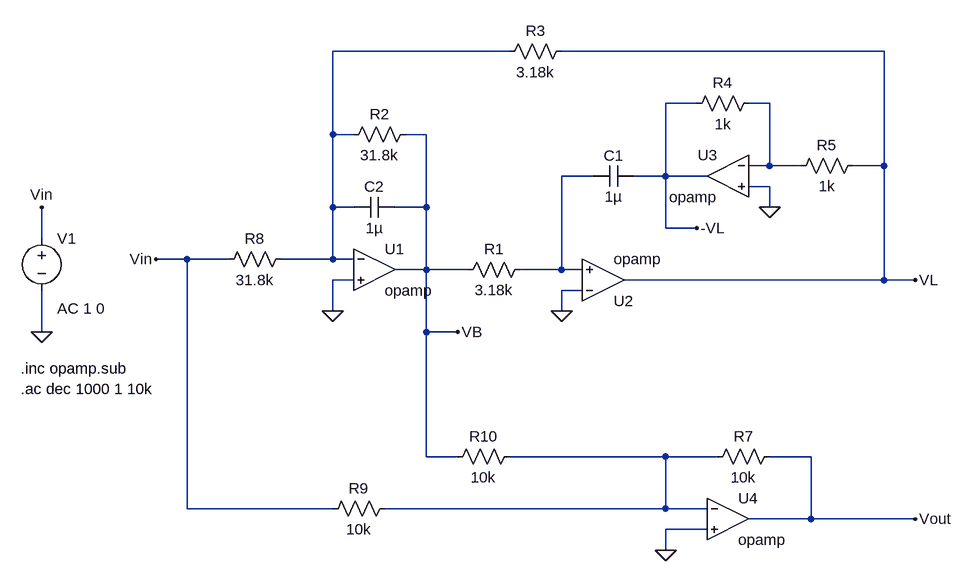
[diagram p0: schematic SimulacionEjercicio8b.asc]
SimulacionEjercicio8b.asc, the LTspice schematic file:
Version 4
SHEET 1 904 680
WIRE 208 -160 -64 -160
WIRE 784 -160 288 -160
WIRE 496 -80 448 -80
WIRE 608 -80 576 -80
WIRE -64 -32 -64 -160
WIRE -32 -32 -64 -32
WIRE 80 -32 48 -32
WIRE 608 16 608 -80
WIRE 608 16 576 16
WIRE 656 16 608 16
WIRE 784 16 784 -160
WIRE 784 16 736 16
WIRE 336 32 288 32
WIRE 448 32 448 -80
WIRE 448 32 400 32
WIRE 512 32 448 32
WIRE 608 48 576 48
WIRE -64 80 -64 -32
WIRE -32 80 -64 80
WIRE 80 80 80 -32
WIRE 80 80 32 80
WIRE 608 80 608 48
WIRE 448 112 448 32
WIRE 496 112 448 112
WIRE -512 128 -512 80
WIRE -288 160 -336 160
WIRE -224 160 -288 160
WIRE -64 160 -64 80
WIRE -64 160 -144 160
WIRE -32 160 -64 160
WIRE 80 176 80 80
WIRE 80 176 32 176
WIRE 144 176 80 176
WIRE 288 176 288 32
WIRE 288 176 224 176
WIRE 320 176 288 176
WIRE -32 192 -64 192
WIRE 784 192 784 16
WIRE 784 192 384 192
WIRE 832 192 784 192
WIRE 320 208 288 208
WIRE -64 240 -64 192
WIRE 288 240 288 208
WIRE -512 272 -512 208
WIRE 80 272 80 176
WIRE 128 272 80 272
WIRE 80 464 80 272
WIRE 128 464 80 464
WIRE 448 464 208 464
WIRE 528 464 448 464
WIRE 672 464 608 464
WIRE -288 544 -288 160
WIRE -64 544 -288 544
WIRE 448 544 448 464
WIRE 448 544 16 544
WIRE 512 544 448 544
WIRE 672 560 672 464
WIRE 672 560 576 560
WIRE 832 560 672 560
WIRE 512 576 448 576
WIRE 448 608 448 576
FLAG 608 80 0
FLAG 288 240 0
FLAG -64 240 0
FLAG 448 608 0
FLAG -336 160 Vin
FLAG 832 192 VL
FLAG 128 272 VB
FLAG 496 112 -VL
FLAG 832 560 Vout
FLAG -512 80 Vin
FLAG -512 272 0
SYMBOL OpAmps\\opamp 0 112 R0
SYMATTR InstName U1
SYMBOL OpAmps\\opamp 352 256 M180
SYMATTR InstName U2
SYMBOL OpAmps\\opamp 544 -32 M0
SYMATTR InstName U3
SYMBOL OpAmps\\opamp 544 496 R0
SYMATTR InstName U4
SYMBOL res 240 160 R90
WINDOW 0 0 56 VBottom 2
WINDOW 3 32 56 VTop 2
SYMATTR InstName R1
SYMATTR Value 3.18k
SYMBOL res 64 -48 R90
WINDOW 0 0 56 VBottom 2
WINDOW 3 32 56 VTop 2
SYMATTR InstName R2
SYMATTR Value 31.8k
SYMBOL res 304 -176 R90
WINDOW 0 0 56 VBottom 2
WINDOW 3 32 56 VTop 2
SYMATTR InstName R3
SYMATTR Value 3.18k
SYMBOL res 592 -96 R90
WINDOW 0 0 56 VBottom 2
WINDOW 3 32 56 VTop 2
SYMATTR InstName R4
SYMATTR Value 1k
SYMBOL res 752 0 R90
WINDOW 0 0 56 VBottom 2
WINDOW 3 32 56 VTop 2
SYMATTR InstName R5
SYMATTR Value 1k
SYMBOL res 512 480 R270
WINDOW 0 32 56 VTop 2
WINDOW 3 0 56 VBottom 2
SYMATTR InstName R7
SYMATTR Value 10k
SYMBOL res -128 144 R90
WINDOW 0 0 56 VBottom 2
WINDOW 3 32 56 VTop 2
SYMATTR InstName R8
SYMATTR Value 31.8k
SYMBOL res 32 528 R90
WINDOW 0 0 56 VBottom 2
WINDOW 3 32 56 VTop 2
SYMATTR InstName R9
SYMATTR Value 10k
SYMBOL res 112 480 R270
WINDOW 0 32 56 VTop 2
WINDOW 3 0 56 VBottom 2
SYMATTR InstName R10
SYMATTR Value 10k
SYMBOL cap 400 16 R90
WINDOW 0 0 32 VBottom 2
WINDOW 3 32 32 VTop 2
SYMATTR InstName C1
SYMATTR Value 1µ
SYMBOL cap 32 64 R90
WINDOW 0 0 32 VBottom 2
WINDOW 3 32 32 VTop 2
SYMATTR InstName C2
SYMATTR Value 1µ
SYMBOL voltage -512 112 R0
WINDOW 123 24 124 Left 2
WINDOW 39 0 0 Left 0
SYMATTR InstName V1
SYMATTR Value ""
SYMATTR Value2 AC 1 0
TEXT -544 328 Left 2 !.inc opamp.sub
TEXT -544 360 Left 2 !.ac dec 1000 1 10k

The netlist it stands for:
* SimulacionEjercicio8b.asc
XU1 N001 0 VB opamp Aol=100K GBW=10Meg  ; pins invin noninvin out
XU2 0 N003 VL opamp Aol=100K GBW=10Meg  ; pins invin noninvin out
XU3 N002 0 -VL opamp Aol=100K GBW=10Meg  ; pins invin noninvin out
XU4 N004 0 Vout opamp Aol=100K GBW=10Meg  ; pins invin noninvin out
R1 N003 VB 3.18k
R2 VB N001 31.8k
R3 VL N001 3.18k
R4 N002 -VL 1k
R5 VL N002 1k
R7 N004 Vout 10k
R8 N001 Vin 31.8k
R9 N004 Vin 10k
R10 VB N004 10k
C1 -VL N003 1µ
C2 VB N001 1µ
V1 Vin 0 AC 1 0
.inc opamp.sub
.ac dec 1000 1 10k
.backanno
.end